# Altium schematic sheet Step-down converter.SchDoc
size A4; SheetNumber: 2; SheetTotal: 4
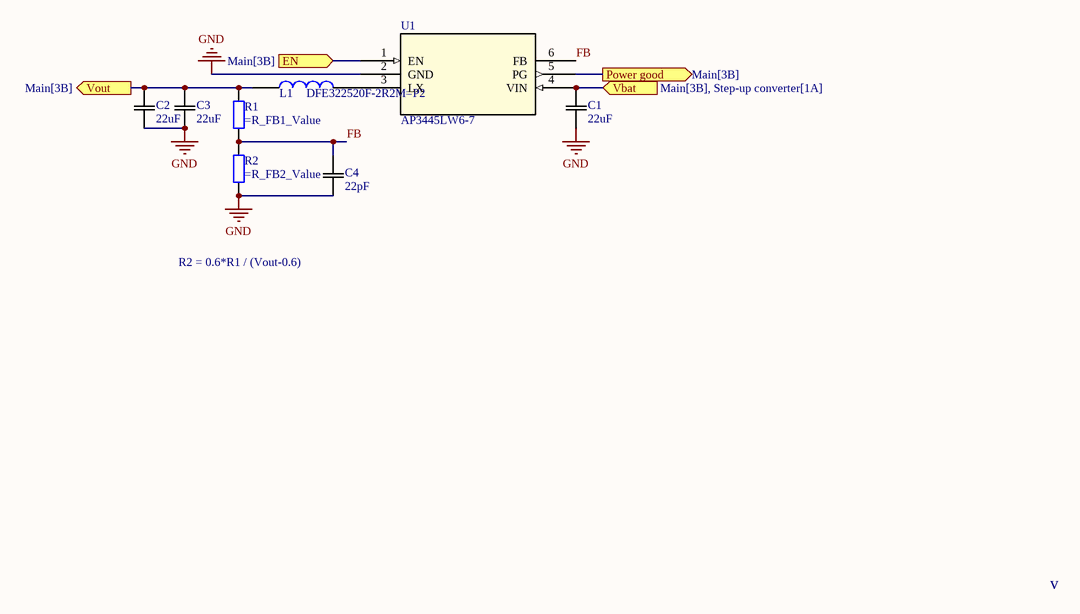
[diagram p0: Step-down converter.SchDoc]

## Parts
C1  22uF  [CAPC2012X94N]
C2  22uF  [CAPC2012X94N]
C3  22uF  [CAPC2012X94N]
C4  22pF  [CAPC2012X94N]
L1  DFE322520F-2R2M=P2  [INDC3225X200N]
R1  (no value)  [0805]
R2  (no value)  [0805]
U1  AP3445LW6-7  [SOT26_AP3445_DIO]

## Ports
EN (in, see Main[3B]), Power good (out, see Main[3B]), Vbat (in, see Main[3B], Step-up converter[1A]), Vout (out, see Main[3B])

## Nets
GND: C1.1 C2.1 C3.1 C4.1 R2.1 U1.2(GND)
EN: U1.1(EN) ; port EN
FB: C4.2 R1.1 R2.2 U1.6(FB)
Power good: U1.5(PG) ; port Power good
Vbat: C1.2 U1.4(VIN) ; port Vbat
Vout: C2.2 C3.2 L1.1 R1.2 ; port Vout
NetL1_2: L1.2 U1.3(LX)

## Notes on the sheet
- R2 = 0.6*R1 / (Vout-0.6)
- v

## Library data of the parts
C1-C4 = CAP 0805: No Description Available; IsInLabBook: Yes
  C1-C3: Value: 22uF
  C4: Value: 22pF
L1 = DFE322520F-2R2M=P2: 2.2 H Shielded Wirewound Inductor 3.3 A 40mOhm Max 1210 (3225 Metric); Manufacturer_Name: Murata Electronics; Geometry.Height: 2mm; Avnet Part Number: *; Avnet Price/Stock: *; Manufacturer_Part_Number: DFE322520F-2R2M=P2; Datasheet Link: https://www.murata.com/-/media/webrenewal/support/library/catalog/products/inductor/chip/o05e.ashx?la=en-us
R1 R2 = Res 0805: Resistor; IsInLabBook: Check
  R1: Value: =R_FB1_Value
  R2: Value: =R_FB2_Value
U1 = AP3445LW6-7: No Description Available; Mfr_Name: Diodes Inc; Copyright: Copyright (C) 2024 Ultra Librarian. All rights reserved.; Manufacturer_Part_Number: AP3445LW6-7; RefDes: RefDes; Type: DEV